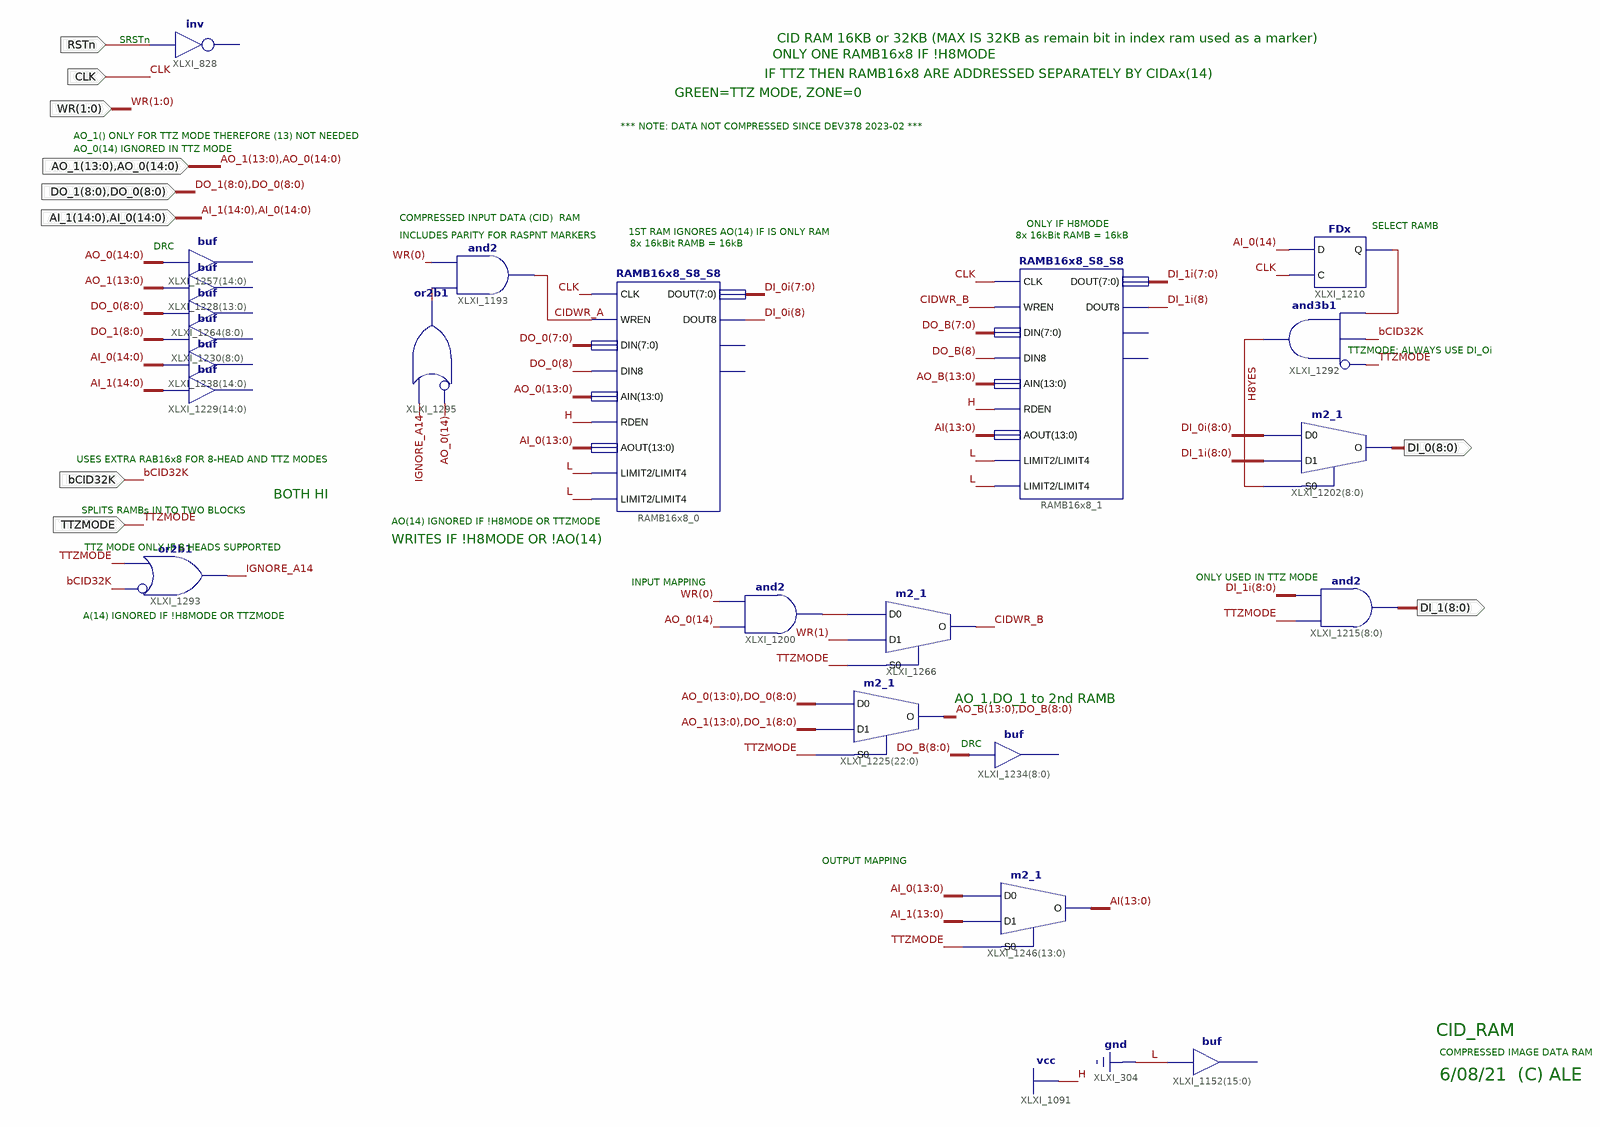
[diagram p0: schematic sheet 1]
// Xilinx ISE schematic CID_RAM.sch (spartan6) as structural Verilog: 22 symbols, 10 ports
module CID_RAM (
  input  CLK,
  input  RSTn,
  input  [14:0] AI_1,
  input  [14:0] AI_0,
  input  [8:0] DO_1,
  input  [8:0] DO_0,
  input  TTZMODE,
  input  [13:0] AO_1,
  input  [14:0] AO_0,
  input  [1:0] WR,
  input  bCID32K,
  output [8:0] DI_1,
  output [8:0] DI_0
);

  wire CIDWR_A, CIDWR_B, H8YES, IGNORE_A14, XLXN_263, XLXN_298, XLXN_307;
  wire [8:0] DI_0i, DI_1i, DO_B;
  wire [13:0] AI, AO_B;

  // inv XLXI_828 has open pins: I=RSTn, O=open
  // buf XLXI_1152[15..0] has open pins: I=1'b0, O=open
  FDx XLXI_1210 (.C(CLK), .D(AI_0[14]), .Q(XLXN_263));
  and XLXI_1193 (CIDWR_A, XLXN_307, WR[0]);
  // buf XLXI_1228[13..0] has open pins: I=AO_1, O=open
  // buf XLXI_1257[14..0] has open pins: I=AO_0, O=open
  // buf XLXI_1230[8..0] has open pins: I=DO_1, O=open
  // buf XLXI_1264[8..0] has open pins: I=DO_0, O=open
  // buf XLXI_1238[14..0] has open pins: I=AI_0, O=open
  // buf XLXI_1229[14..0] has open pins: I=AI_1, O=open
  m2_1 XLXI_1246[13:0] (.D0(AI_0[13:0]), .D1(AI_1[13:0]), .S0(TTZMODE), .O(AI));
  m2_1 XLXI_1266 (.D0(XLXN_298), .D1(WR[1]), .S0(TTZMODE), .O(CIDWR_B));
  and XLXI_1200 (XLXN_298, AO_0[14], WR[0]);
  m2_1 XLXI_1225[22:0] (.D0({AO_0[13:0], DO_0}), .D1({AO_1, DO_1}), .S0(TTZMODE), .O({AO_B, DO_B}));
  // buf XLXI_1234[8..0] has open pins: I=DO_B, O=open
  assign DI_1 = {9{TTZMODE}} & DI_1i;  // and2 XLXI_1215[8..0], 9 bits wide
  and XLXI_1292 (H8YES, ~TTZMODE, bCID32K, XLXN_263);  // and3b1
  m2_1 XLXI_1202[8:0] (.D0(DI_0i), .D1(DI_1i), .S0(H8YES), .O(DI_0));
  or XLXI_1293 (IGNORE_A14, ~bCID32K, TTZMODE);  // or2b1
  or XLXI_1295 (XLXN_307, ~AO_0[14], IGNORE_A14);  // or2b1
  RAMB16x8_S8_S8 RAMB16x8_0 (
    .AIN(AO_0[13:0]), .AOUT(AI_0[13:0]), .CLK(CLK), .DIN(DO_0[7:0]), .DIN8(DO_0[8]), .DOUT(DI_0i[7:0]),
    .DOUT8(DI_0i[8]), .LIMIT2(1'b0), .LIMIT4(1'b0), .RDEN(1'b1), .WREN(CIDWR_A));  // open: CRASH, CRASH2
  RAMB16x8_S8_S8 RAMB16x8_1 (
    .AIN(AO_B), .AOUT(AI), .CLK(CLK), .DIN(DO_B[7:0]), .DIN8(DO_B[8]), .DOUT(DI_1i[7:0]), .DOUT8(DI_1i[8]),
    .LIMIT2(1'b0), .LIMIT4(1'b0), .RDEN(1'b1), .WREN(CIDWR_B));  // open: CRASH, CRASH2

  // Notes on the sheet:
  //   CID RAM 16KB or 32KB (MAX IS 32KB as remain bit in index ram used as a marker)
  //   SRSTn
  //   ONLY ONE RAMB16x8 IF !H8MODE
  //   IF TTZ THEN RAMB16x8 ARE ADDRESSED SEPARATELY BY CIDAx(14)
  //   GREEN=TTZ MODE, ZONE=0
  //   *** NOTE: DATA NOT COMPRESSED SINCE DEV378 2023-02 ***
  //   AO_1() ONLY FOR TTZ MODE THEREFORE (13) NOT NEEDED
  //   AO_0(14) IGNORED IN TTZ MODE
  //   COMPRESSED INPUT DATA (CID)  RAM
  //   ONLY IF H8MODE
  //   SELECT RAMB
  //   1ST RAM IGNORES AO(14) IF IS ONLY RAM
  //   INCLUDES PARITY FOR RASPNT MARKERS
  //   8x 16kBit RAMB = 16kB
  //   8x 16kBit RAMB = 16kB
  //   DRC
  //   TTZMODE: ALWAYS USE DI_Oi
  //   USES EXTRA RAB16x8 FOR 8-HEAD AND TTZ MODES
  //   BOTH HI
  //   SPLITS RAMBs IN TO TWO BLOCKS
  //   AO(14) IGNORED IF !H8MODE OR TTZMODE
  //   WRITES IF !H8MODE OR !AO(14)
  //   TTZ MODE ONLY IF 8 HEADS SUPPORTED
  //   ONLY USED IN TTZ MODE
  //   INPUT MAPPING
  //   A(14) IGNORED IF !H8MODE OR TTZMODE
  //   AO_1,DO_1 to 2nd RAMB
  //   DRC
  //   OUTPUT MAPPING
  //   CID_RAM
  //   COMPRESSED IMAGE DATA RAM
  //   6/08/21  (C) ALE
endmodule
